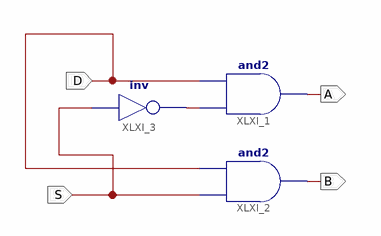
[diagram p0: schematic sheet 1]
// Xilinx ISE schematic dmx1_2_1b.sch (spartan3e) as structural Verilog: 3 symbols, 4 ports
module dmx1_2_1b (
  input  D,
  input  S,
  output A,
  output B
);

  wire XLXN_3;

  and XLXI_1 (A, XLXN_3, D);
  and XLXI_2 (B, S, D);
  not XLXI_3 (XLXN_3, S);
endmodule
